# EAGLE design ReflowCntrl (EAGLE 7.7.0)
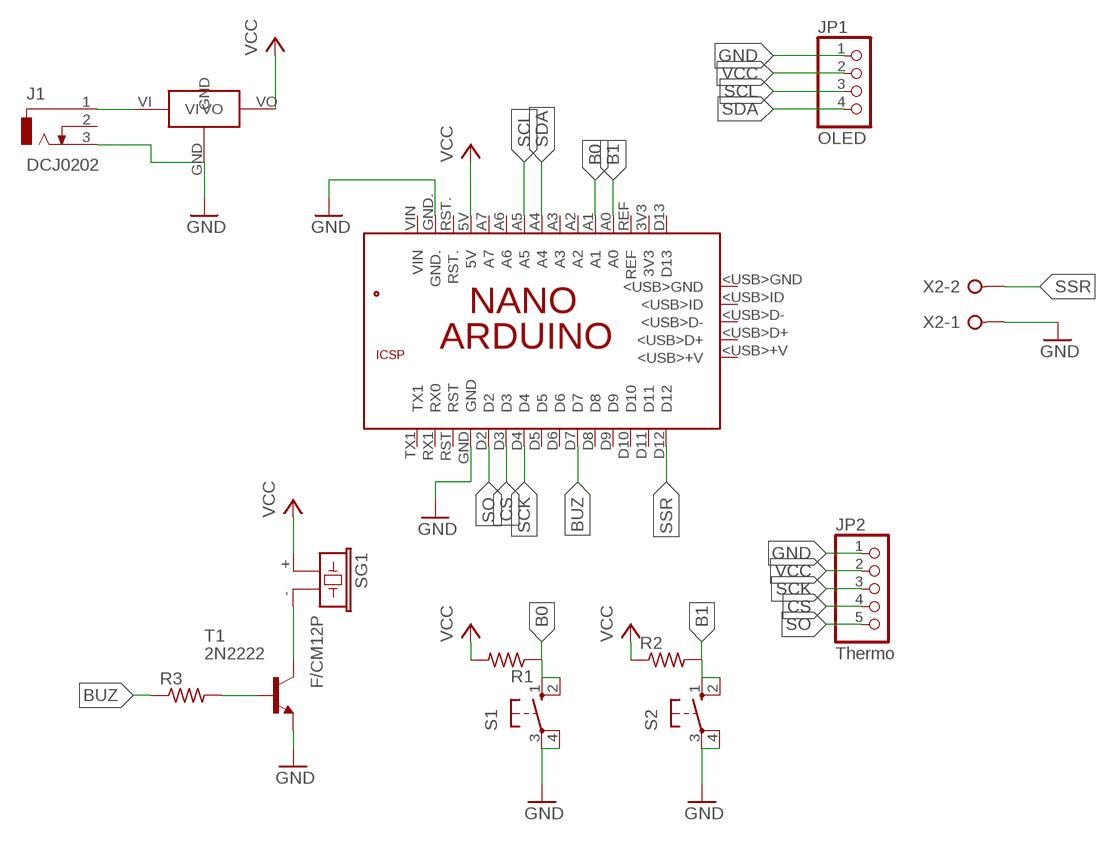
[diagram p0: schematic, sheet 1]

## Parts
J1  DCJ0202  [DCJ0202]
JP1  OLED  PINHD-1X4  [1X04]
JP2  Thermo  PINHD-1X5  [1X05]
PCB1  ARDUINO_NANO  [ARDUINO_NANO]
R1  R-US_0207/10  [0207/10]
R2  R-US_0207/10  [0207/10]
R3  R-US_0207/10  [0207/10]
S1  10-XX  [B3F-10XX]
S2  10-XX  [B3F-10XX]
SG1  F/CM12P  [F/CM12P]
T1  2N2222  [TO92-EBC-OVAL]
U$1  7805-TO220V  [TO220AV]
X2  W237-02P  [W237-132]

## Nets
B0: PCB1.A1 R1.1 S1.1(S) S1.2(S1)
B1: PCB1.A0 R2.2 S2.1(S) S2.2(S1)
BUZ: PCB1.D7 R3.1
CS: JP2.4 PCB1.D3
GND: J1.3 JP1.1 JP2.1 PCB1.GND PCB1.GND. S1.3(P) S1.4(P1) S2.3(P) S2.4(P1) T1.E U$1.GND X2.1
N$1: SG1.- T1.C
N$2: R3.2 T1.B
N$5: J1.1 U$1.VI
SCK: JP2.3 PCB1.D4
SCL: JP1.3 PCB1.A5
SDA: JP1.4 PCB1.A4
SO: JP2.5 PCB1.D2
SSR: PCB1.D12 X2.2
VCC: JP1.2 JP2.2 PCB1.5V R1.2 R2.1 SG1.+ U$1.VO
Unconnected: J1.2 PCB1.3V3 PCB1.5V. PCB1.<USB>+V PCB1.<USB>D+ PCB1.<USB>D- PCB1.<USB>GND PCB1.<USB>ID PCB1.A2 PCB1.A3 PCB1.A6 PCB1.A7 PCB1.D5 PCB1.D6 PCB1.D8 PCB1.D9 PCB1.D10 PCB1.D11 PCB1.D13 PCB1.GND_ PCB1.MISO PCB1.MOSI PCB1.REF PCB1.RESET.. PCB1.RST PCB1.RST. PCB1.RX1(RX0) PCB1.SCK PCB1.TX1 PCB1.VIN

## Library data of the parts
J1 = con-jack-jke:DCJ0202: DC POWER JACK Source: DCJ0202.pdf; OC_FARNELL: unknown; OC_NEWARK: unknown
JP1 = pinhead:PINHD-1X4: PIN HEADER
JP2 = pinhead:PINHD-1X5: PIN HEADER
PCB1 = E14_Arduino_revC:ARDUINO_NANO: Device for representing an Arduino Nano board with a footprint in an EAGLE design. Created by Dave Young for Element14. More EAGLE documentation at: http://www.element14.com/community/community/knode/cadsoft_eagle
R1-R3 = rcl:R-US_: RESISTOR, American symbol
S1 S2 = switch-omron:10-XX: OMRON SWITCH; MPN: B3F-1000; OC_FARNELL: 176432; OC_NEWARK: 36M3542
SG1 = buzzer:F/CM12P: BUZZER Source: Buerklin; OC_FARNELL: unknown; OC_NEWARK: unknown
T1 = adafruit:2N2222: NPN TRANSISTOR Big oval pads
U$1 = LM7805:7805-TO220V
X2 = con-wago-508:W237-02P: WAGO SREW CLAMP; OC_FARNELL: unknown; OC_NEWARK: unknown

## Board
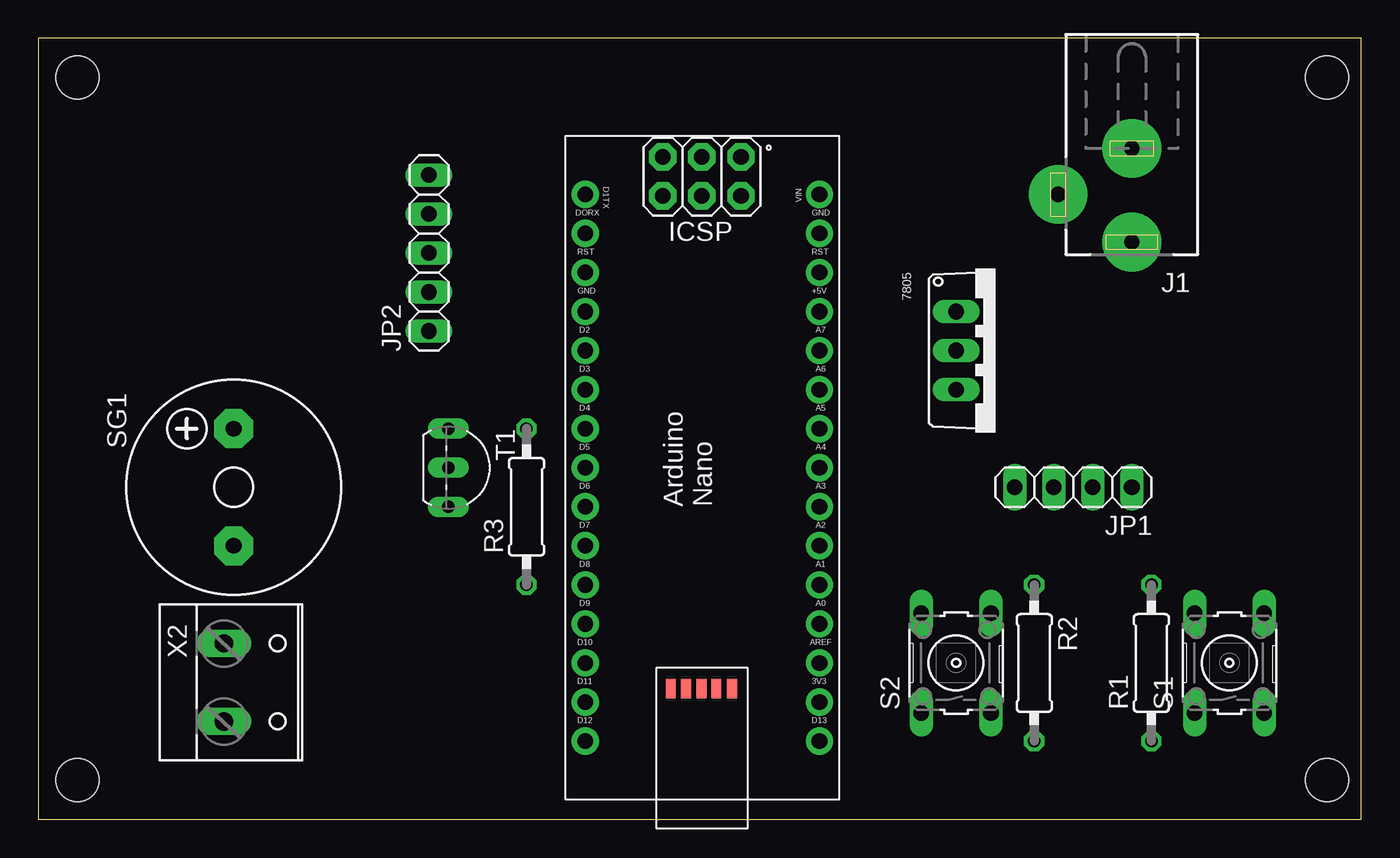
[diagram p1: board, top side]
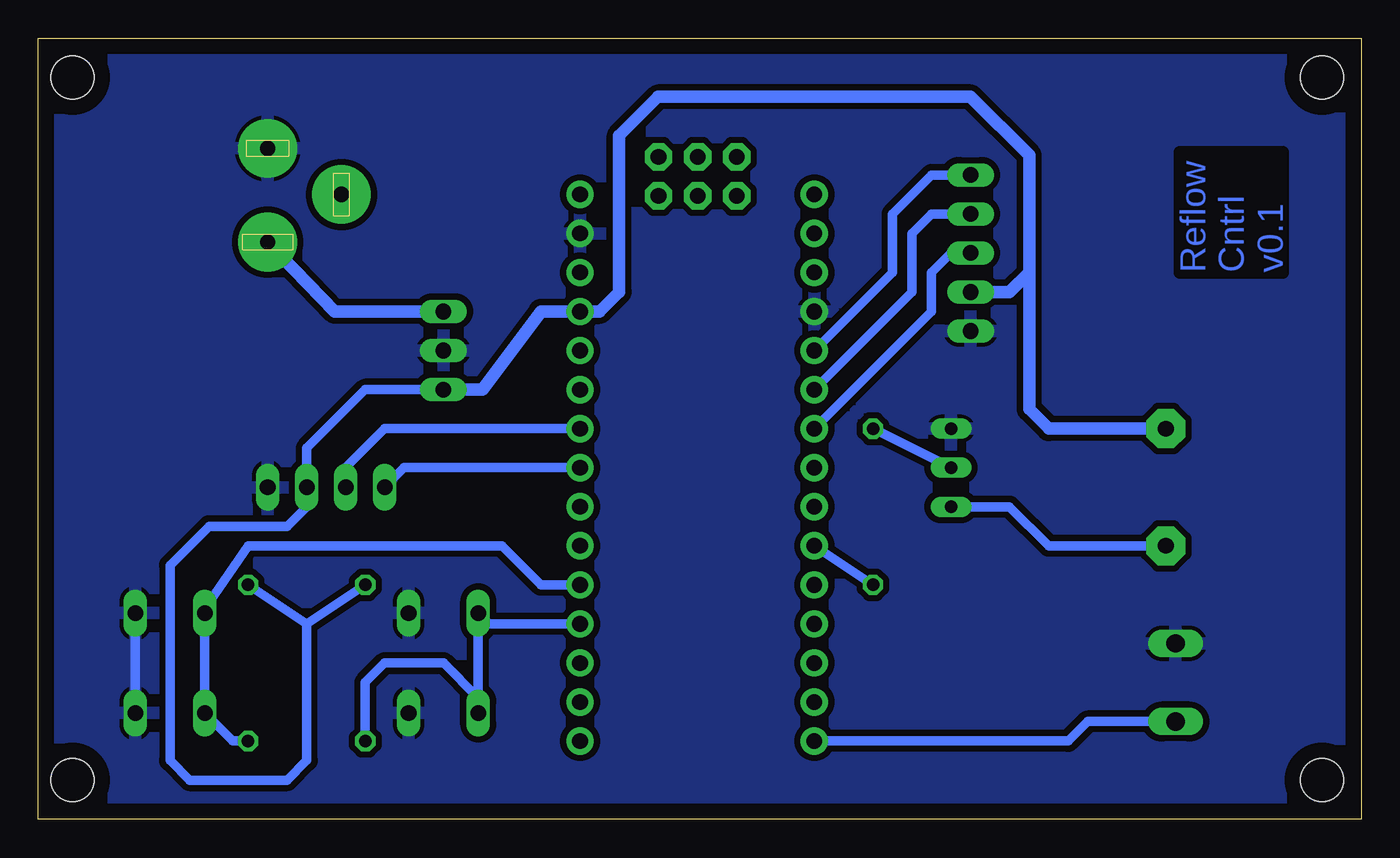
[diagram p2: board, bottom side, seen from below]

Size 86.03 x 50.79 mm. Coordinates in mm from the lower left corner, seen from the top.
Outline: 0,0 86.03,0 86.03,50.79 0,50.79 0,0
Copper layers (1*16): Top 0.035mm / dielectric 1.5mm / Bottom 0.035mm
Design rules "default": minimum track width 10mil, minimum drill 24mil, track to track 8mil, track to pad 8mil, pad to pad 8mil, via to via 8mil, smd to smd 8mil, copper to edge 40mil, drill to drill 8mil, minimum pad ring 10mil, minimum via ring 8mil, stop-mask expansion 4mil, vias tented up to drill 0mil, thermal gap 10mil
Holes 2.8 mm at 83.82,48.26 83.82,2.54 2.54,2.54 2.54,48.26

### Footprints (pad centres in the part's own frame; a part is rotated, then mirrored left to right if it is on the bottom)
DCJ0202 = drill 1 pad 3.81: 1 0,3.1; 2 4.8,0; 3 0,-3
1X04 = drill 1.016 long: 1 -3.81,0; 2 -1.27,0; 3 1.27,0; 4 3.81,0
1X05 = drill 1.016 long: 1 -5.08,0; 2 -2.54,0; 3 0,0; 4 2.54,0; 5 5.08,0
ARDUINO_NANO = drill 1.016 pad 1.778: 3V3 6.35,1.27; 5V 31.75,1.27; A0 11.43,1.27; A1 13.97,1.27; A2 16.51,1.27; A3 19.05,1.27; A4 21.59,1.27; A5 24.13,1.27; A6 26.67,1.27; A7 29.21,1.27; D2 29.21,16.51; D3 26.67,16.51; D4 24.13,16.51; D5 21.59,16.51; D6 19.05,16.51; D7 16.51,16.51; D8 13.97,16.51; D9 11.43,16.51; D10 8.89,16.51; D11 6.35,16.51; D12 3.81,16.51; D13 3.81,1.27; GND 31.75,16.51; GND. 36.83,1.27; REF 8.89,1.27; RST 34.29,16.51; RST. 34.29,1.27; RX1 36.83,16.51; TX1 39.37,16.51; VIN 39.37,1.27 | drill 1.016 pad 1.778 octagon: 5V. 39.268,6.375; GND_ 39.268,11.455; MISO 41.808,6.375; MOSI 39.268,8.915; RESET.. 41.808,11.455; SCK 41.808,8.915 | smd 1.27 x 0.635: <USB>+V 7.214,10.947; <USB>D+ 7.214,9.957; <USB>D- 7.214,8.941; <USB>GND 7.214,6.96; <USB>ID 7.214,7.976
0207/10 = drill 0.813 octagon: 1 -5.08,0; 2 5.08,0
B3F-10XX = drill 1.016 long: 1 -3.251,2.261; 2 3.251,2.261; 3 -3.251,-2.261; 4 3.251,-2.261
F/CM12P = drill 1.016 pad 2.54 octagon: + 3.81,0; - -3.81,0
TO92-EBC-OVAL = drill 0.813 long: B 0,-1.27; C 2.54,-1.27; E -2.54,-1.27
TO220AV = drill 1.016 long: GND 0,-2.54; VI -2.54,-2.54; VO 2.54,-2.54
W237-132 = drill 1.194 long: 1 -2.54,-0.635; 2 2.54,-0.635

### Placement (x,y rotation side)
J1  71.12,40.64 180 top
JP1  67.31,21.59 180 top
JP2  25.4,36.83 90 top
PCB1  52.07,1.27 90 top
R1  72.39,10.16 90 top
R2  64.77,10.16 270 top
R3  31.75,20.32 90 top
S1  77.47,10.16 90 top
S2  59.69,10.16 90 top
SG1  12.7,21.59 90 top
T1  27.94,22.86 270 top
U$1  62.23,30.48 270 top
X2  12.7,8.89 270 top

### Tracks (layer width: path | path; a pad name or v marks a point on that pad's centre or on a via)
B0
  Bottom 0.61: PCB1.A1 53.34,15.24 55.88,17.78 72.39,17.78 75.21,13.69 S1.2 S1.1 73.38,5.08 R1.1
B1
  Bottom 0.61: PCB1.A0 56.72,12.7 S2.2 S2.1 57.43,7.9 59.69,10.16 63.5,10.16 64.77,8.89 R2.2
BUZ
  Bottom 0.61: R3.1 PCB1.D7
CS
  Bottom 0.61: JP2.4 27.94,39.37 29.21,38.1 29.21,34.29 PCB1.D3
GND
  Bottom 0.61: S1.4 S1.3
  pour Bottom (isolate 0.406): 0,50.8 86.36,50.8 86.36,0 0,0
N$1
  Bottom 0.61: SG1.- 20.32,17.78 22.86,20.32 T1.C
N$2
  Bottom 0.61: R3.2 T1.B
N$5
  Bottom 0.813: U$1.VI 66.75,33.02 J1.1
SCK
  Bottom 0.61: JP2.3 26.67,36.83 27.94,35.56 27.94,33.02 PCB1.D4
SCL
  Bottom 0.61: PCB1.A5 63.5,25.4 66.04,22.86 JP1.3
SDA
  Bottom 0.61: PCB1.A4 62.23,22.86 JP1.4
SO
  Bottom 0.61: JP2.5 27.94,41.91 30.48,39.37 30.48,35.56 PCB1.D2
SSR
  Bottom 0.61: X2.2 17.78,6.35 19.05,5.08 PCB1.D12
VCC
  Bottom 0.61: 68.58,12.7 68.58,3.81 69.85,2.54 76.2,2.54 77.47,3.81 77.47,16.51 74.93,19.05 69.85,19.05 68.58,20.32 JP1.2 68.58,24.13 64.77,27.94 U$1.VO | 68.58,12.7 R2.1 | R1.2 68.58,12.7
  Bottom 0.813: JP2.2 22.86,34.29 21.59,35.56 | 21.59,35.56 21.59,43.18 25.4,46.99 45.72,46.99 48.26,44.45 48.26,34.29 49.53,33.02 PCB1.5V 53.34,33.02 57.15,27.94 U$1.VO | SG1.+ 20.32,25.4 21.59,26.67 21.59,35.56

### Text on the board
Bottom: Reflow / Cntrl / v0.1